# EAGLE schematic NightLight (EAGLE 9.6.1)
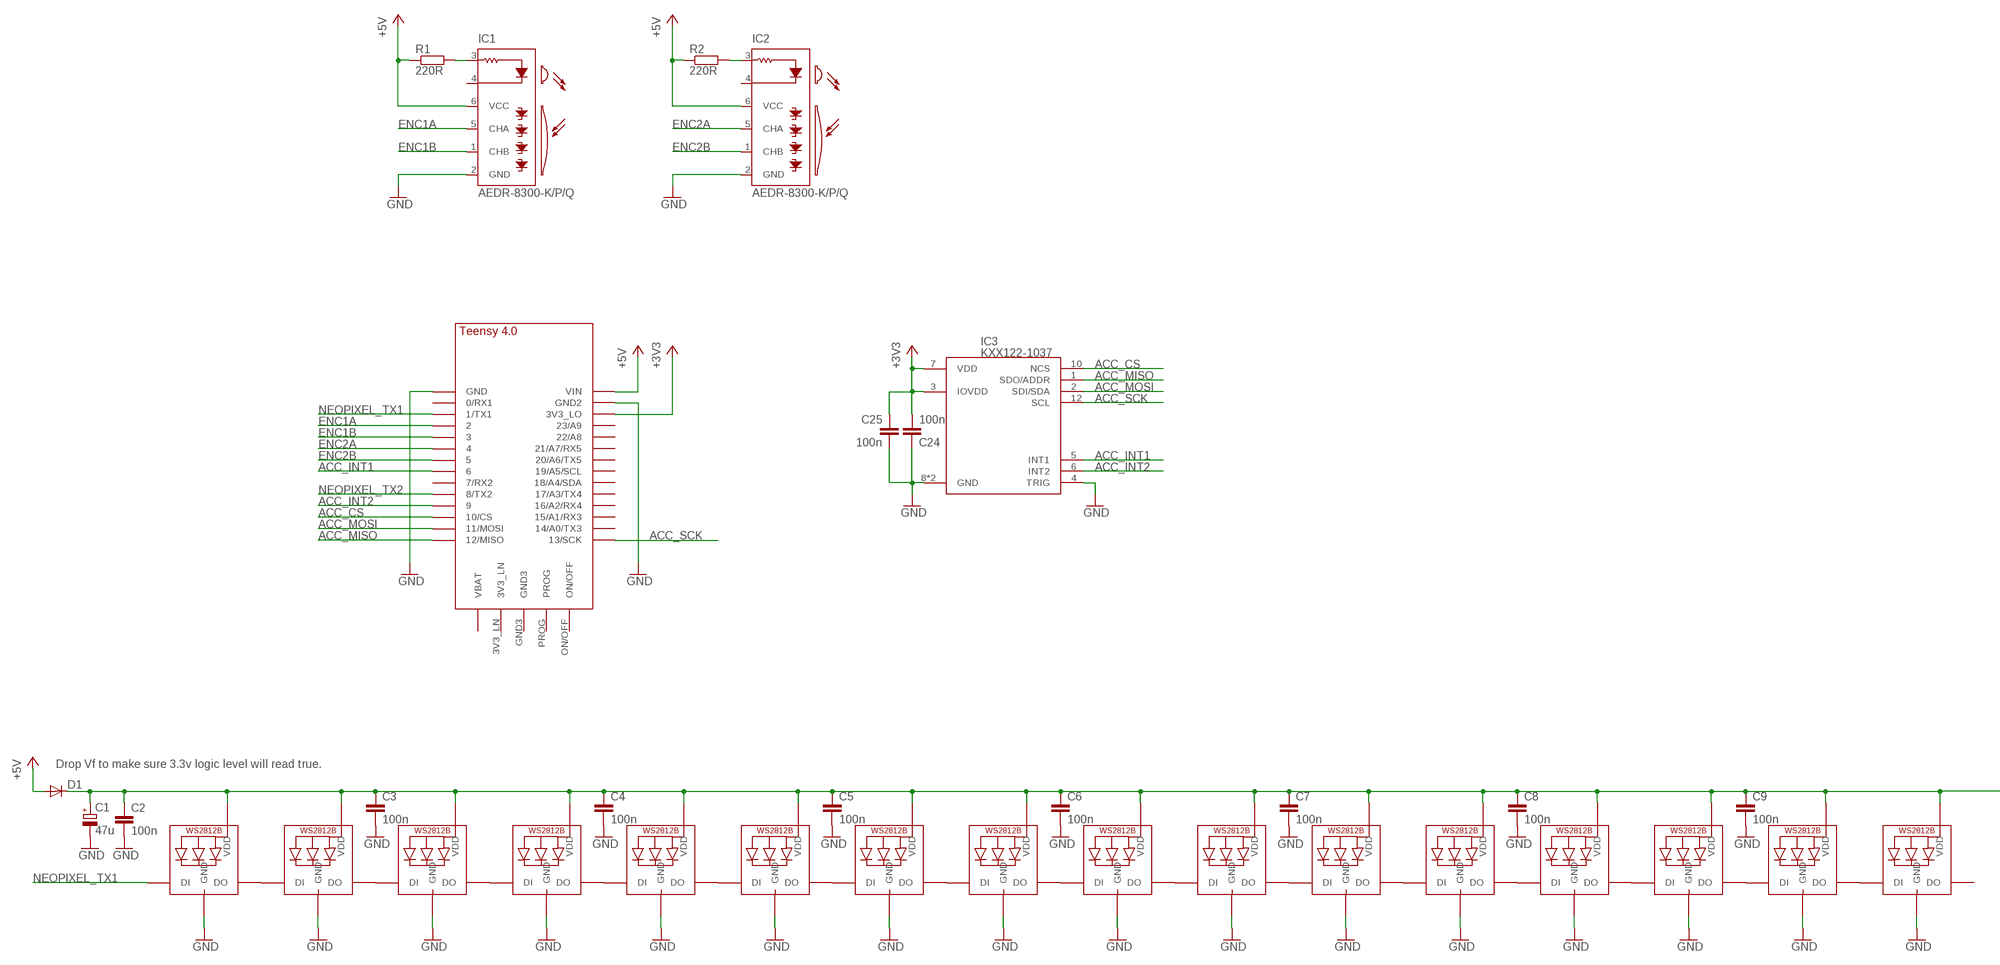
[diagram p0: schematic, sheet 1, part 1 of 2]
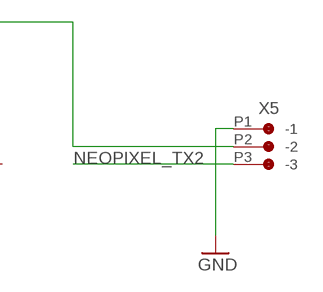
[diagram p1: schematic, sheet 1, part 2 of 2]

## Parts
C1  47u  CPOL-EU153CLV-0505  [CPOL-5]
C2  100n  C-EUC0603  [C0603]
C3  100n  C-EUC0603  [C0603]
C4  100n  C-EUC0603  [C0603]
C5  100n  C-EUC0603  [C0603]
C6  100n  C-EUC0603  [C0603]
C7  100n  C-EUC0603  [C0603]
C8  100n  C-EUC0603  [C0603]
C9  100n  C-EUC0603  [C0603]
C24  100n  C-EUC0603  [C0603]
C25  100n  C-EUC0603  [C0603]
D1  DIODE1N4001  [DIODE-1N4001]
IC1  AEDR-8300-K/P/Q  [AEDR-8300]
IC2  AEDR-8300-K/P/Q  [AEDR-8300]
IC3  KXX122-1037  [LGA16R50P4X4_200X200X100]
LED1  WS2812B5050  [WS2812B]
LED2  WS2812B5050  [WS2812B]
LED3  WS2812B5050  [WS2812B]
LED4  WS2812B5050  [WS2812B]
LED5  WS2812B5050  [WS2812B]
LED6  WS2812B5050  [WS2812B]
LED7  WS2812B5050  [WS2812B]
LED8  WS2812B5050  [WS2812B]
LED9  WS2812B5050  [WS2812B]
LED10  WS2812B5050  [WS2812B]
LED11  WS2812B5050  [WS2812B]
LED12  WS2812B5050  [WS2812B]
LED13  WS2812B5050  [WS2812B]
LED14  WS2812B5050  [WS2812B]
LED15  WS2812B5050  [WS2812B]
LED16  WS2812B5050  [WS2812B]
R1  220R  R-EU_0603  [0603]
R2  220R  R-EU_0603  [0603]
U$1  TEENSY_4.0-BASIC  [TEENSY_4.0-BASIC]
X5  CON-JST_PH_3W  [CON-JST_PH_3W]

## Nets
+3V3: C24.2 C25.1 IC3.3(IOVDD) IC3.7(VDD) U$1.3V3_LO
+5V: D1.A IC1.6(VCC) IC2.6(VCC) R1.1 R2.1 U$1.VIN
ACC_CS: IC3.10(NCS) U$1.10/CS
ACC_INT1: IC3.5(INT1) U$1.6
ACC_INT2: IC3.6(INT2) U$1.9/CS
ACC_MISO: IC3.1(SDO/ADDR) U$1.12/MISO
ACC_MOSI: IC3.2(SDI/SDA) U$1.11/MOSI
ACC_SCK: IC3.12(SCL) U$1.13/SCK
ENC1A: IC1.5(CHA) U$1.2
ENC1B: IC1.1(CHB) U$1.3/CANTX
ENC2A: IC2.5(CHA) U$1.4/CANRX
ENC2B: IC2.1(CHB) U$1.5
GND: C1.- C2.2 C3.2 C4.2 C5.2 C6.2 C7.2 C8.2 C9.2 C24.1 C25.2 IC1.2(GND) IC2.2(GND) IC3.4(TRIG) IC3.8(GND) IC3.9(GND) LED1.3-GND(GND) LED2.3-GND(GND) LED3.3-GND(GND) LED4.3-GND(GND) LED5.3-GND(GND) LED6.3-GND(GND) LED7.3-GND(GND) LED8.3-GND(GND) LED9.3-GND(GND) LED10.3-GND(GND) LED11.3-GND(GND) LED12.3-GND(GND) LED13.3-GND(GND) LED14.3-GND(GND) LED15.3-GND(GND) LED16.3-GND(GND) U$1.GND U$1.GND2 X5.P1(-1)
N$1: IC1.3(A) R1.2
N$2: C1.+ C2.1 C3.1 C4.1 C5.1 C6.1 C7.1 C8.1 C9.1 D1.C LED1.1-VDD(VDD) LED2.1-VDD(VDD) LED3.1-VDD(VDD) LED4.1-VDD(VDD) LED5.1-VDD(VDD) LED6.1-VDD(VDD) LED7.1-VDD(VDD) LED8.1-VDD(VDD) LED9.1-VDD(VDD) LED10.1-VDD(VDD) LED11.1-VDD(VDD) LED12.1-VDD(VDD) LED13.1-VDD(VDD) LED14.1-VDD(VDD) LED15.1-VDD(VDD) LED16.1-VDD(VDD) X5.P2(-2)
N$3: IC2.3(A) R2.2
N$4: LED1.2-DOUT(DO) LED2.4-DIN(DI)
N$6: LED2.2-DOUT(DO) LED3.4-DIN(DI)
N$8: LED3.2-DOUT(DO) LED4.4-DIN(DI)
N$10: LED4.2-DOUT(DO) LED5.4-DIN(DI)
N$12: LED5.2-DOUT(DO) LED6.4-DIN(DI)
N$14: LED6.2-DOUT(DO) LED7.4-DIN(DI)
N$16: LED7.2-DOUT(DO) LED8.4-DIN(DI)
N$17: LED9.2-DOUT(DO) LED10.4-DIN(DI)
N$18: LED10.2-DOUT(DO) LED11.4-DIN(DI)
N$19: LED11.2-DOUT(DO) LED12.4-DIN(DI)
N$20: LED12.2-DOUT(DO) LED13.4-DIN(DI)
N$21: LED13.2-DOUT(DO) LED14.4-DIN(DI)
N$22: LED14.2-DOUT(DO) LED15.4-DIN(DI)
N$23: LED15.2-DOUT(DO) LED16.4-DIN(DI)
N$24: LED8.2-DOUT(DO) LED9.4-DIN(DI)
NEOPIXEL_TX1: LED1.4-DIN(DI) U$1.1/TX(1/TX1)
NEOPIXEL_TX2: U$1.8(8/TX2) X5.P3(-3)
Unconnected: IC1.4(C) IC2.4(C) LED16.2-DOUT(DO) U$1.0/RX(0/RX1) U$1.3V3_LN U$1.7(7/RX2) U$1.14/A0(14/A0/TX3) U$1.15/A1(15/A1/RX3) U$1.16/A2(16/A2/RX4) U$1.17/A3(17/A3/TX4) U$1.18/A4/SDA U$1.19/A5/SCL U$1.20/A6(20/A6/TX5) U$1.21/A7(21/A7/RX5) U$1.22/A8 U$1.23/A9 U$1.GND3 U$1.ON/OFF U$1.PROG U$1.VBAT\(VBAT)

## Notes on the sheet
- Drop Vf to make sure 3.3v logic level will read true.

## Power pins joined to a net without a drawn wire
GND: IC1.E1(GND) IC1.E2(GND) IC2.E1(GND) IC2.E2(GND)

## Library data of the parts
C1 = Rebel:CPOL-EU: POLARIZED CAPACITOR, European symbol
C2-C9 C24 C25 = Rebel:C-EU: CAPACITOR, European symbol
D1 = Rebel:DIODE: Diode These are standard reverse protection diodes and small signal diodes. SMA package can handle up to about 1A. SOD-323 can handle about 200mA. Watch the SOD-323 package when ordering, there are some mfgs out there that are 5-pin packages.
IC1 IC2 = optocoupler:AEDR-8300-K: Agilent AEDR-8300 Series Encoders Reflective Surface Mount Optical Encoder Source: http: http://www.avagotech.com .. AV02-0088EN-1.pdf; MF: AGILENT TECHNOLOGIES; MPN: AEDR-8300-1P2; OC_FARNELL: 1161102; OC_NEWARK: 08J1020
IC3 = Mogees:KXX122-1037
LED1-LED16 = adafruit:WS2812B
R1 R2 = Rebel:R-EU_: RESISTOR, European symbol
U$1 = Teensy-4.0:TEENSY_4.0-BASIC
X5 = Rebel:CON-JST_PH_3W